# Altium schematic sheet STM32.SchDoc: STM32
size A3; DocumentNumber: 18; Revision: 1.0; SheetNumber: 3; SheetTotal: 4
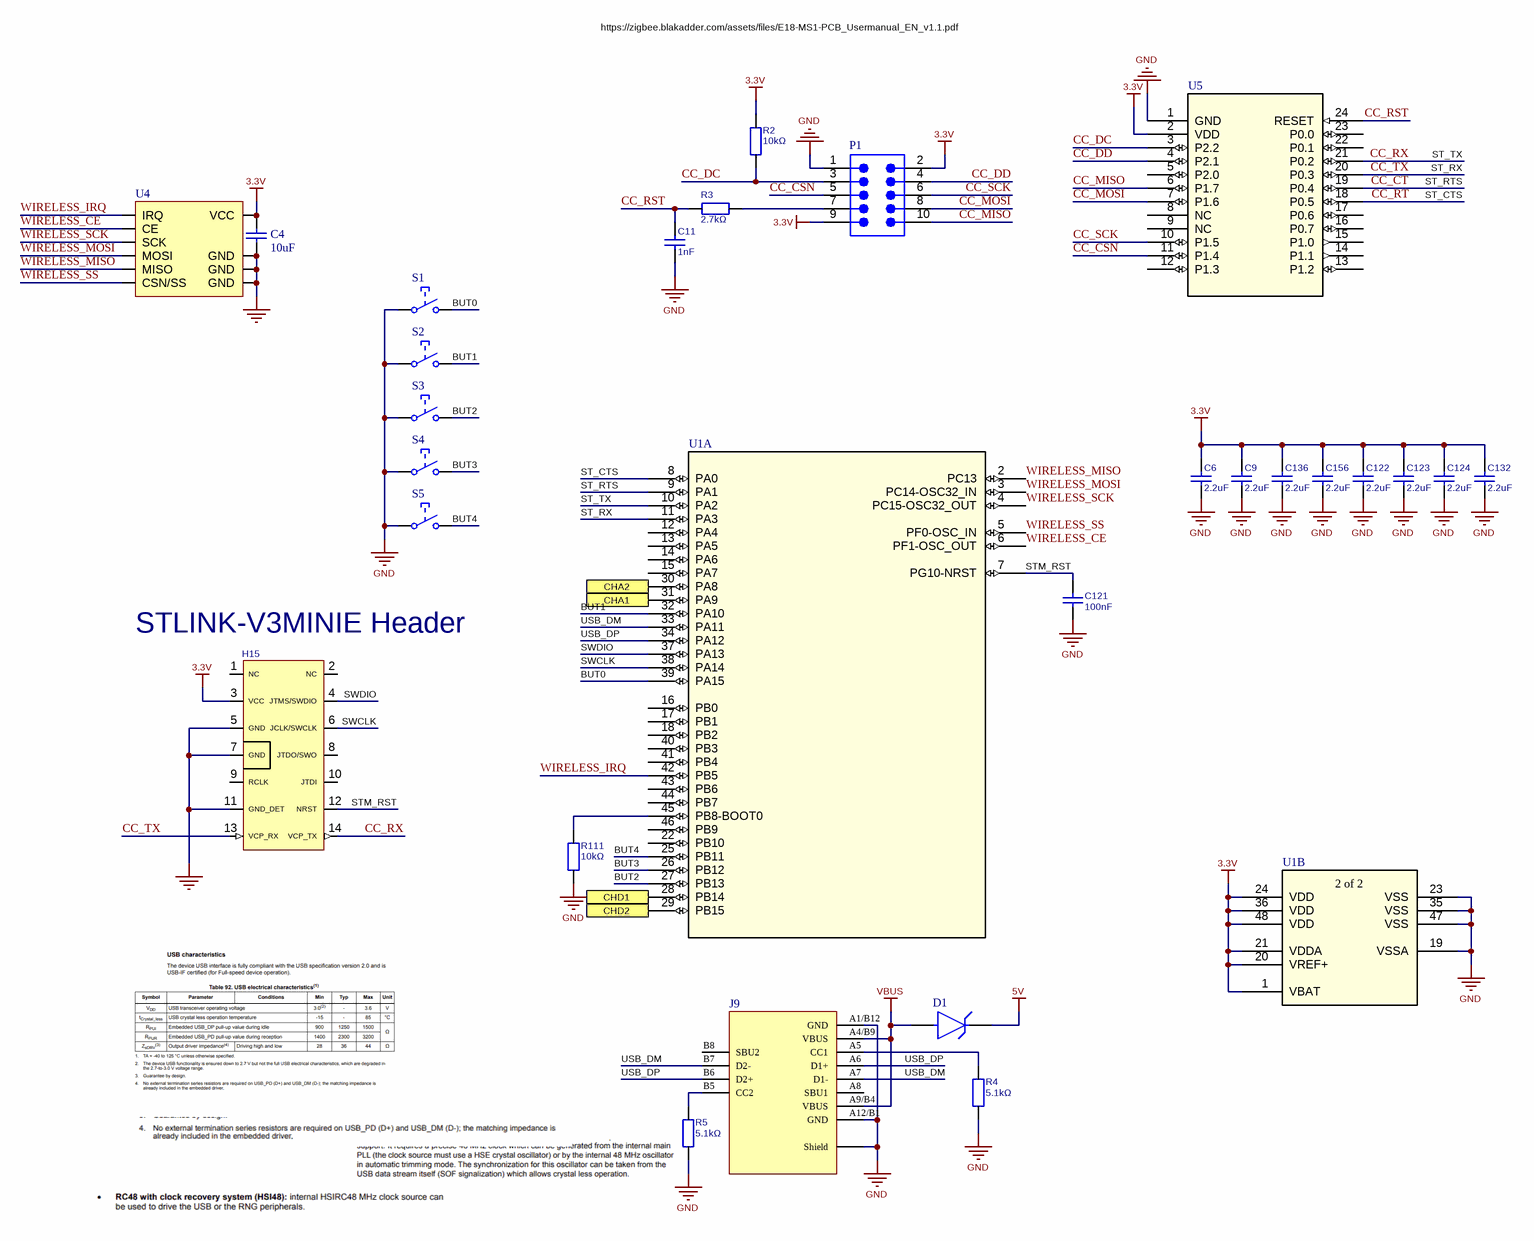
[diagram p0: STM32.SchDoc]

## Parts
C4  value 10uF  [CAPC1608X08N]
C6  value 2.2uF  [CAPC1005X05N]
C9  value 2.2uF  [CAPC1005X05N]
C11  value 1nF  [CAPC1005X05N]
C121  value 100nF  [CAPC1005X05N]
C122  value 2.2uF  [CAPC1005X05N]
C123  value 2.2uF  [CAPC1005X05N]
C124  value 2.2uF  [CAPC1005X05N]
C132  value 2.2uF  [CAPC1005X05N]
C136  value 2.2uF  [CAPC1005X05N]
C156  value 2.2uF  [CAPC1005X05N]
D1  (no value)  [SOD123]
H15  (no value)  [Header 2x7 [14] 1.27mm Male TH]
J9  (no value)  [USB4105-GF-A-Footprint-1]
P1  (no value)  [62201021121]
R2  value 10kΩ  [RESC1005X04N]
R3  value 2.7kΩ  [RESC1005X04N]
R4  value 5.1kΩ  [RESC1005X04N]
R5  value 5.1kΩ  [RESC1005X04N]
R111  value 10kΩ  [RESC1005X04N]
S1  (no value)  [SWITCH - 4x3 SMD - 2 pin]
S2  (no value)  [SWITCH - 4x3 SMD - 2 pin]
S3  (no value)  [SWITCH - 4x3 SMD - 2 pin]
S4  (no value)  [SWITCH - 4x3 SMD - 2 pin]
S5  (no value)  [SWITCH - 4x3 SMD - 2 pin]
U1  (no value)  [LQFP48-7x7mm]  (parts A,B of 2)
U4  (no value)  [E01-2G4M13S]
U5  (no value)  [E18-MS1-PCB_BYT]

## Ports
CHA1 (out), CHA2 (out), CHD1 (out), CHD2 (out)

## Nets
3.3V: C4.1 C6.2 C9.2 C122.2 C123.2 C124.2 C132.2 C136.2 C156.2 H15.3(VCC) P1.2 P1.9 R2.1 U1.1(VBAT) U1.20(VREF+) U1.21(VDDA) U1.24(VDD) U1.36(VDD) U1.48(VDD) U4.1(VCC) U5.2(VDD)
5V: D1.2(C)
GND: C4.2 C6.1 C9.1 C11.1 C121.1 C122.1 C123.1 C124.1 C132.1 C136.1 C156.1 H15.5(GND) H15.7(GND) H15.11(GND_DET) J9.A1/B12(GND) J9.A12/B1(GND) J9.MNT(Shield) P1.1 R4.2 R5.2 R111.2 S1.1 S2.1 S3.1 S4.1 S5.1 U1.19(VSSA) U1.23(VSS) U1.35(VSS) U1.47(VSS) U4.8(GND) U4.9(GND) U4.10(GND) U5.1(GND)
VBUS: D1.1(A) J9.A4/B9(VBUS) J9.A9/B4(VBUS)
BUT0: S1.2 U1.39(PA15)
BUT1: S2.2 U1.32(PA10)
BUT2: S3.2 U1.27(PB13)
BUT3: S4.2 U1.26(PB12)
BUT4: S5.2 U1.25(PB11)
CC_CSN: P1.5 U5.11(P1.4)
CC_CT: U1.9(PA1) U5.19(P0.4)  [also labelled ST_RTS]
CC_DC: P1.3 R2.2 U5.3(P2.2)
CC_DD: P1.4 U5.4(P2.1)
CC_MISO: P1.10 U5.6(P1.7)
CC_MOSI: P1.8 U5.7(P1.6)
CC_RST: C11.2 R3.2 U5.24(RESET)
CC_RT: U1.8(PA0) U5.18(P0.5)  [also labelled ST_CTS]
CC_RX: H15.14(VCP_TX) U1.10(PA2) U5.21(P0.2)  [also labelled ST_TX]
CC_SCK: P1.6 U5.10(P1.5)
CC_TX: H15.13(VCP_RX) U1.11(PA3) U5.20(P0.3)  [also labelled ST_RX]
CHA1: U1.31(PA9) ; port CHA1
CHA2: U1.30(PA8) ; port CHA2
CHD1: U1.28(PB14) ; port CHD1
CHD2: U1.29(PB15) ; port CHD2
STM_RST: C121.2 H15.12(NRST) U1.7(PG10-NRST)
SWCLK: H15.6(JCLK/SWCLK) U1.38(PA14)
SWDIO: H15.4(JTMS/SWDIO) U1.37(PA13)
USB_DM: J9.A7(D1-) J9.B7(D2-) U1.33(PA11)
USB_DP: J9.A6(D1+) J9.B6(D2+) U1.34(PA12)
WIRELESS_CE: U1.6(PF1-OSC_OUT) U4.2(CE)
WIRELESS_IRQ: U1.42(PB5) U4.7(IRQ)
WIRELESS_MISO: U1.2(PC13) U4.6(MISO)
WIRELESS_MOSI: U1.3(PC14-OSC32_IN) U4.5(MOSI)
WIRELESS_SCK: U1.4(PC15-OSC32_OUT) U4.4(SCK)
WIRELESS_SS: U1.5(PF0-OSC_IN) U4.3(CSN/SS)
NetJ9_A5: J9.A5(CC1) R4.1
NetJ9_B5: J9.B5(CC2) R5.1
NetP1_7: P1.7 R3.1
NetR111_1: R111.1 U1.45(PB8-BOOT0)

Not connected (* = marked no-connect by the designer): H15 1(NC) 2(NC) 8(JTDO/SWO) 9(RCLK) 10(JTDI); J9 A8(SBU1) B8(SBU2); U1 12(PA4) 13(PA5) 14(PA6) 15(PA7) 16(PB0) 17(PB1) 18(PB2) 22(PB10) 40(PB3) 41(PB4) 43(PB6) 44(PB7) 46(PB9); U5 5(P2.0) 8(NC) 9(NC) 12(P1.3) 13(P1.2) 14(P1.1) 15(P1.0) 16(P0.7) 17(P0.6) 22(P0.1) 23(P0.0)

## Notes on the sheet
- https://zigbee.blakadder.com/assets/files/E18-MS1-PCB_Usermanual_EN_v1.1.pdf
- (near H15) STLINK-V3MINIE Header
- Redako
- Keilestraat 5a, 3029BP, Rotterdam, M: david@redako.nl, T: +31 6 16001008
- Project
- Title
- Customer
- Size:
- Date:
- File:
- A4
- Revision:
- Time:
- Drawn by:
- GIT Revision:
- Sheet:
- of
- (in symbol STM32G474CBT6TR, part B) 2 of 2

## Library data of the parts
C4 C6 C9 C11 C122-C124 C132 C136 C156 = SMD_Cap
  C4: Package: 0603
  C6 C9 C11 C122-C124 C132 C136 C156: Package: 0402
C121 = SMD_Cap: Manufacturer: Samsung; MPN: CL05B104KB54PNC; Type: X7R; Rating: 50V; Tolerance: ±10%; Package: 0402; JLC Part Type: Basic; JLCPCB Part #: C307331
D1 = f813f71cba58e380607f5dd3caf9714: BZT52C20-7-F BZT52C20 Series 20 V 10 mA 500 mW Surface Mount Zener Diode - SOD-123; MPN: B5819W SL; Package: SOD-123; JLCPCB Part #: C8598
H15 = STLINK-V3MINIE_14P_TH: MPN: DW127R-22-14-23
J9 = USB C USB4105-GF-A-120: Manufacturer: Sofng; MPN: MC-311D; Package: SMD; JLCPCB Part #: C136423
P1 = CMP-1502-00948-3: MPN: 1271WV-2x5P
R2 R111 = Res: MPN: 0402WGF1002TCE; Manufacturer: Uniroyal; Rating: 50V; Tolerance: ±1%; Package: 0402; JLC Part Type: Basic; JLCPCB Part #: C25744
R3-R5 = Res: Manufacturer: Uniroyal; Rating: 50V; Tolerance: ±1%; Package: 0402
S1-S5 = TS-1088R-02026: SPST 50MA @ 12VDC VERTICAL ROUND BUTTON 260GF SMD,3X4X2.0MM TACTILE SWITCHES ROHS; Manufacturer: XUNPU; Value: 50mA, 12VDC; MPN: TS-1088R-02026; Package: SMD,3x4x2.0mm; JLC Part Type: Extended; JLCPCB Part #: C455280
U1 = STM32G474CBT6TR: No Description Available; MPN: STM32G474CBT6TR
U4 = E01-ML01SP4: MPN: E01-2G4M13S
U5 = E18-MS1-PCB: No Description Available; MPN: E18-MS1-PCB